# Altium schematic sheet Microcontroller.SchDoc: Payload Card Microcontroller
size A2; Revision: 1A; SheetNumber: 4; SheetTotal: 4; Organization: Brickworks; Address1: Matthew Glazer; Address2: Design Engineer
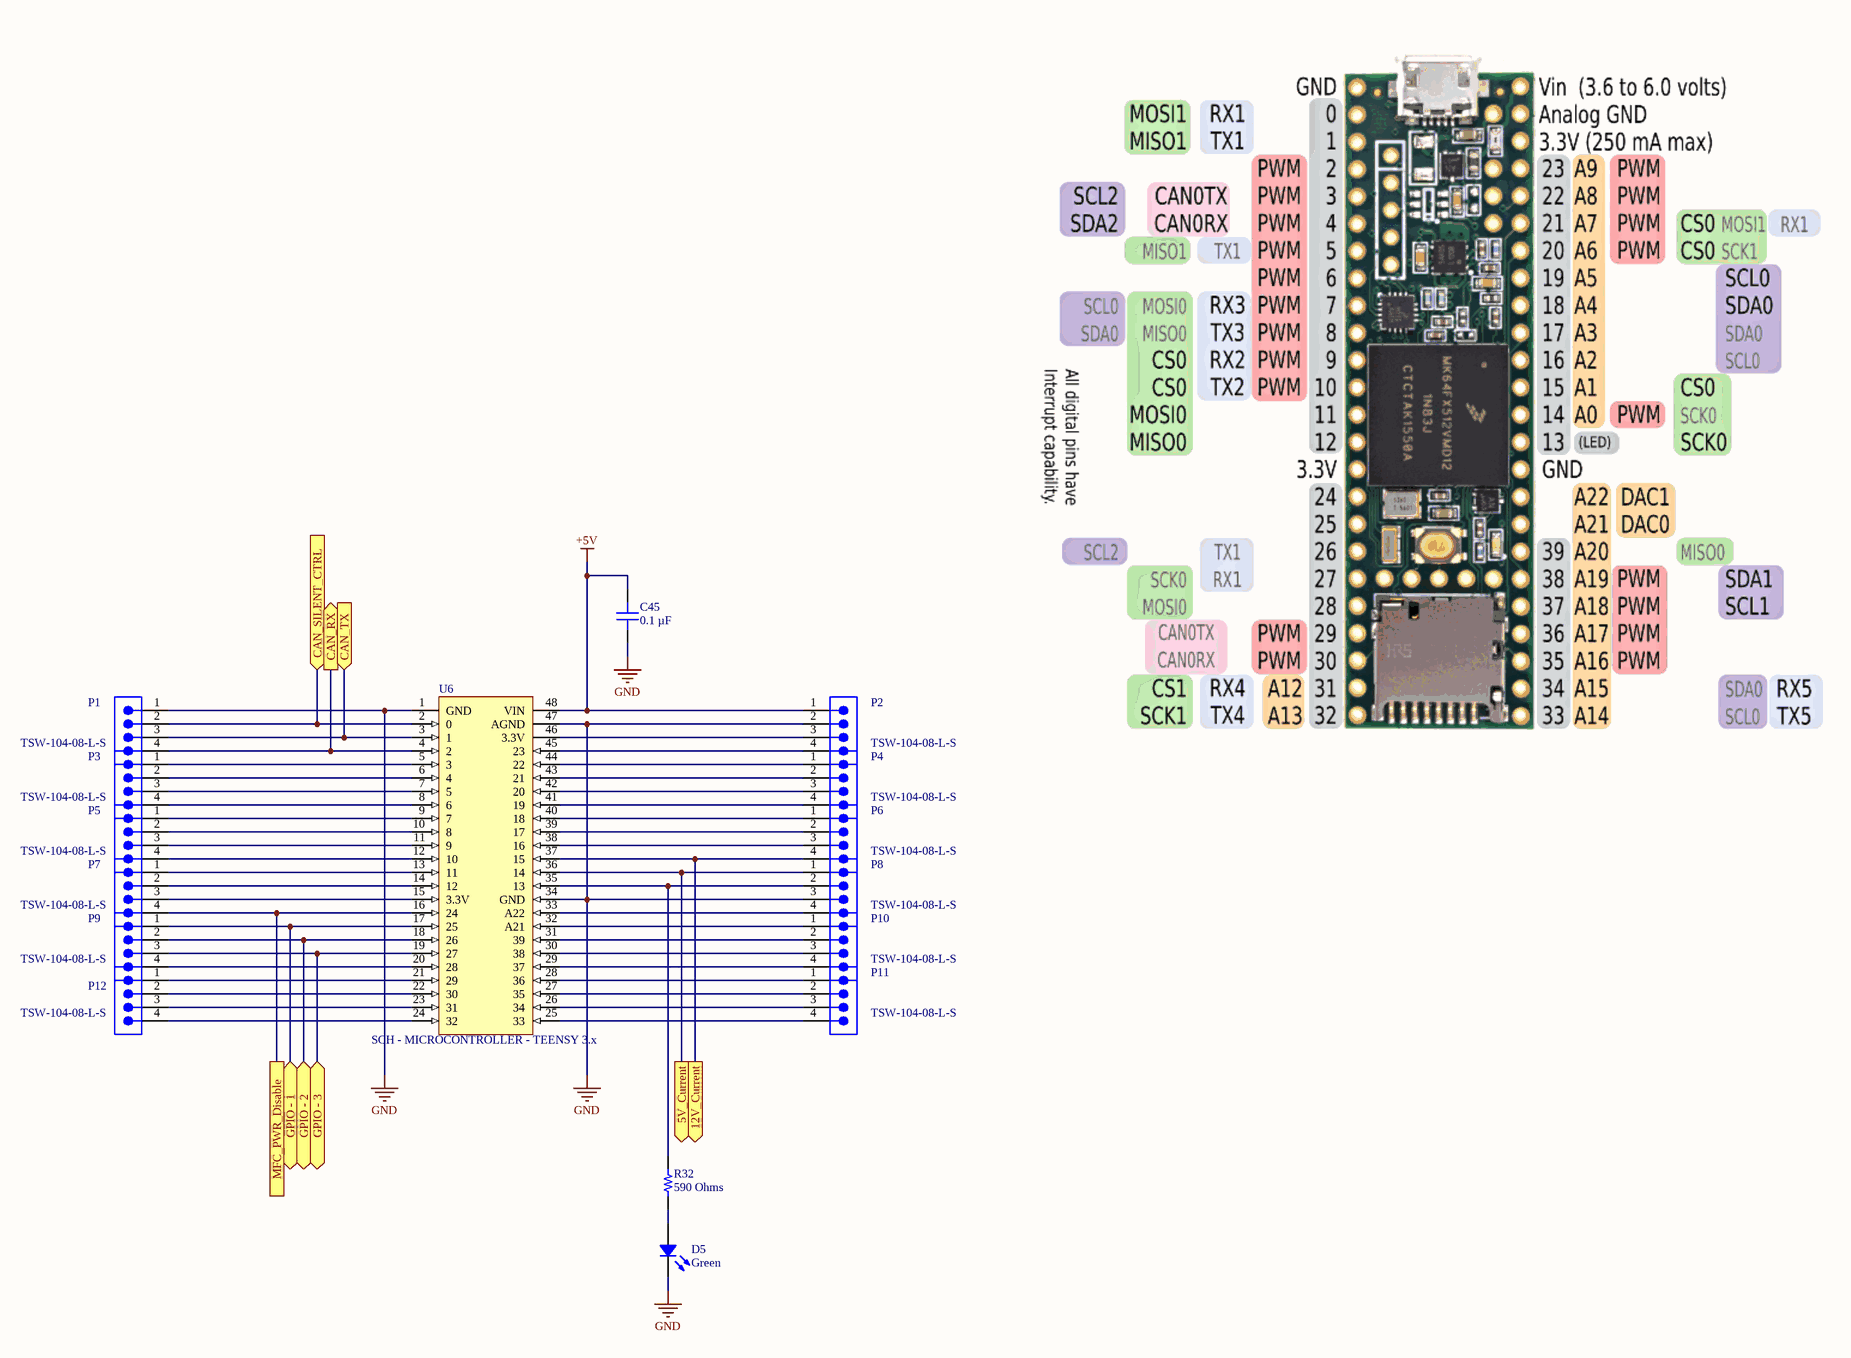
[diagram p0: Microcontroller.SchDoc]

## Parts
C45  0.1 µF  [CAP 0603_1608]
D5  Green  [LED 0603_1608 GREEN]
P1  TSW-104-08-L-S  [SMTC-TSW-104-08-X-S]
P2  TSW-104-08-L-S  [SMTC-TSW-104-08-X-S]
P3  TSW-104-08-L-S  [SMTC-TSW-104-08-X-S]
P4  TSW-104-08-L-S  [SMTC-TSW-104-08-X-S]
P5  TSW-104-08-L-S  [SMTC-TSW-104-08-X-S]
P6  TSW-104-08-L-S  [SMTC-TSW-104-08-X-S]
P7  TSW-104-08-L-S  [SMTC-TSW-104-08-X-S]
P8  TSW-104-08-L-S  [SMTC-TSW-104-08-X-S]
P9  TSW-104-08-L-S  [SMTC-TSW-104-08-X-S]
P10  TSW-104-08-L-S  [SMTC-TSW-104-08-X-S]
P11  TSW-104-08-L-S  [SMTC-TSW-104-08-X-S]
P12  TSW-104-08-L-S  [SMTC-TSW-104-08-X-S]
R32  590 Ohms  [RES 0603_1608]
U6  SCH - MICROCONTROLLER - TEENSY 3.x  [PCB - THRU - TEENSY 3.x]

## Ports
5V_Current (out), 12V_Current (out), CAN_RX (out), CAN_SILENT_CTRL (in), CAN_TX (in), GPIO - 1 (bidir), GPIO - 2 (bidir), GPIO - 3 (bidir), MFC_PWR_Disable

## Nets
+5V: C45.1 P2.1 U6.48(VIN)
GND: C45.2 D5.2 P1.1 P2.2 P8.3 U6.1(GND) U6.34(GND) U6.47(AGND)
5V_Current: P8.1 U6.36(14) ; port 5V_Current
12V_Current: P6.4 U6.37(15) ; port 12V_Current
CAN_RX: P1.4 U6.4(2) ; port CAN_RX
CAN_SILENT_CTRL: P1.2 U6.2(0) ; port CAN_SILENT_CTRL
CAN_TX: P1.3 U6.3(1) ; port CAN_TX
GPIO - 1: P9.1 U6.17(25) ; port GPIO - 1
GPIO - 2: P9.2 U6.18(26) ; port GPIO - 2
GPIO - 3: P9.3 U6.19(27) ; port GPIO - 3
MFC_PWR_Disable: P7.4 U6.16(24) ; port MFC_PWR_Disable
NetD5_1: D5.1 R32.1
NetP2_3: P2.3 U6.46(3.3V)
NetP2_4: P2.4 U6.45(23)
NetP3_1: P3.1 U6.5(3)
NetP3_2: P3.2 U6.6(4)
NetP3_3: P3.3 U6.7(5)
NetP3_4: P3.4 U6.8(6)
NetP4_1: P4.1 U6.44(22)
NetP4_2: P4.2 U6.43(21)
NetP4_3: P4.3 U6.42(20)
NetP4_4: P4.4 U6.41(19)
NetP5_1: P5.1 U6.9(7)
NetP5_2: P5.2 U6.10(8)
NetP5_3: P5.3 U6.11(9)
NetP5_4: P5.4 U6.12(10)
NetP6_1: P6.1 U6.40(18)
NetP6_2: P6.2 U6.39(17)
NetP6_3: P6.3 U6.38(16)
NetP7_1: P7.1 U6.13(11)
NetP7_2: P7.2 U6.14(12)
NetP7_3: P7.3 U6.15(3.3V)
NetP8_2: P8.2 R32.2 U6.35(13)
NetP8_4: P8.4 U6.33(A22)
NetP9_4: P9.4 U6.20(28)
NetP10_1: P10.1 U6.32(A21)
NetP10_2: P10.2 U6.31(39)
NetP10_3: P10.3 U6.30(38)
NetP10_4: P10.4 U6.29(37)
NetP11_1: P11.1 U6.28(36)
NetP11_2: P11.2 U6.27(35)
NetP11_3: P11.3 U6.26(34)
NetP11_4: P11.4 U6.25(33)
NetP12_1: P12.1 U6.21(29)
NetP12_2: P12.2 U6.22(30)
NetP12_3: P12.3 U6.23(31)
NetP12_4: P12.4 U6.24(32)

## Notes on the sheet
- Title
- Size:
- Date:
- File:
- A2
- Number:
- Time:
- Revision:
- Sheet
- of

## Library data of the parts
C45 = CL10B104KB8NNWC: CAP CER 0.1UF 50V X7R 0603; manufacturer: Samsung Electro-Mechanics; Tolerance: ±10%; Part Number: CL10B104KB8NNWC; Value: 0.1 µF; Applications: General Purpose; Capacitance: 0.1 µF; componentlink1description: Datasheet; componentlink1url: http://www.samsungsem.com/kr/support/product-search/mlcc/CL10B104KB8NNWC.jsp; componentlink2description: DigiKey Link; componentlink2url: https://www.digikey.com/en/products/detail/samsung-electro-mechanics/CL10B104KB8NNWC/3887593; Device Package: 0603 (1608 Metric); lastupdated: 3/8/2022 9:16:52 PM; Lifecycle Status: Active; Minimum Order: 1; Mounting Type: Surface Mount, MLCC; Operating Temperature: -55°C ~ 125°C; Package / Case: 0603 (1608 Metric); packaging: CutTape; partid: 16078; Part Status: Active; price: 0.01; series: CL; Size / Dimension: 0.063" L x 0.031" W (1.60mm x 0.80mm); Supplier 1: DigiKey; Supplier Part Number 1: 1276-1935-1-ND; Temperature Coefficient: X7R; Thickness (Max): 0.035" (0.90mm); Voltage - Rated: 50V
D5 = LTST-C193KGKT-5A: LED GREEN CLEAR CHIP SMD; Manufacturer: Lite-On Inc.; Configuration: Standard; Current - Test: 5mA; Lens Color: Colorless; Lens Size: 1.15mm x 0.80mm; Lens Style: Rectangle with Flat Top; Millicandela Rating: 16.25mcd; Viewing Angle: 130°; Voltage - Forward (Vf) (Typ): 2V; Wavelength - Dominant: 572nm; Wavelength - Peak: 574nm; Part Number: LTST-C193KGKT-5A; Color: Green; ComponentLink1Description: Datasheet; ComponentLink1URL: http://optoelectronics.liteon.com/upload/download/DS22-2007-0094/LTST-C193KGKT-5A.PDF; ComponentLink2Description: DigiKey Link; ComponentLink2URL: http://digikey.com/product-detail/en/lite-on-inc/LTST-C193KGKT-5A/160-1828-1-ND/2356247; Device Package: 0603 (1608 Metric); Height (Max): 0.45mm; LastUpdated: 9/2/2020 1:20:41 AM; Lens Transparency: Clear; Lifecycle Status: Active; Minimum Order: 1; Mounting Type: Surface Mount; Package / Case: 0603 (1608 Metric); Packaging: TapeAndReel; PartId: 694; Part Status: Active; Price: 0.06; Series: -; Size / Dimension: 1.60mm L x 0.80mm W; Supplier 1: DigiKey; Supplier Part Number 1: 160-1828-1-ND; Supplier Device Package: Chip LED; Value: Green
P1-P12 = CMP-1024-00358-1: 0.025" SQ Post Header, Through-hole, Vertical, -55 to 125 degC, 2.54 mm Pitch, 4-Pin, Male, RoHS; Manufacturer: Samtec; Pitch: 2.54 mm; PartNumber: TSW-104-08-L-S; RoHS: True; Temperature Range: -55 to 125 degC; PackageDescription: .025[0.64] SQ. Post Terminal Strip Assembly; Orientation: Vertical; ComponentLink2URL: http://www.samtec.com/documents/webfiles/pdf/TSW_TH.PDF; ComponentLink1Description: Manufacturer URL; ComponentLink2Description: Datasheet; PackageVersion: DM, 8/1988; ComponentLink3URL: http://www.samtec.com/documents/webfiles/cpdf/TSW-XXX-XX-XXX-X-XX-XXX-MKT.pdf; Mounting Technology: Through-hole; PackageReference: TSW-104-08-X-S; ComponentLink3Description: Package Specification; ComponentLink1URL: http://www.samtec.com; DatasheetVersion: F-214
R32 = RMCF0603FT590R: RES 590 OHM 1% 1/10W 0603; Manufacturer: Stackpole Electronics Inc; Power (Watts): 0.1W, 1/10W; Temperature Coefficient: ±100ppm/°C; Part Number: RMCF0603FT590R; Value: 590 Ohms; ComponentLink1Description: Datasheet; ComponentLink1URL: https://www.seielect.com/catalog/sei-rmcf_rmcp.pdf; ComponentLink2Description: DigiKey Link; ComponentLink2URL: http://digikey.com/product-detail/en/stackpole-electronics-inc/RMCF0603FT590R/RMCF0603FT590RCT-ND/2418096; Composition: Thick Film; Device Package: 0603 (1608 Metric); Features: Automotive AEC-Q200; Height - Seated (Max): 0.022" (0.55mm); LastUpdated: 9/2/2020 1:09:40 AM; Lifecycle Status: Active; Minimum Order: 1; Number of Terminations: 2; Operating Temperature: -55°C ~ 155°C; Package / Case: 0603 (1608 Metric); Packaging: CutTape; PartId: 23847; Part Status: Active; Price: 0.10; Ratings: AEC-Q200; Resistance: 590 Ohms; Series: RMCF; Size / Dimension: 0.061" L x 0.031" W (1.55mm x 0.80mm); Supplier 1: DigiKey; Supplier Part Number 1: RMCF0603FT590RCT-ND; Supplier Device Package: 0603; Tolerance: ±1%